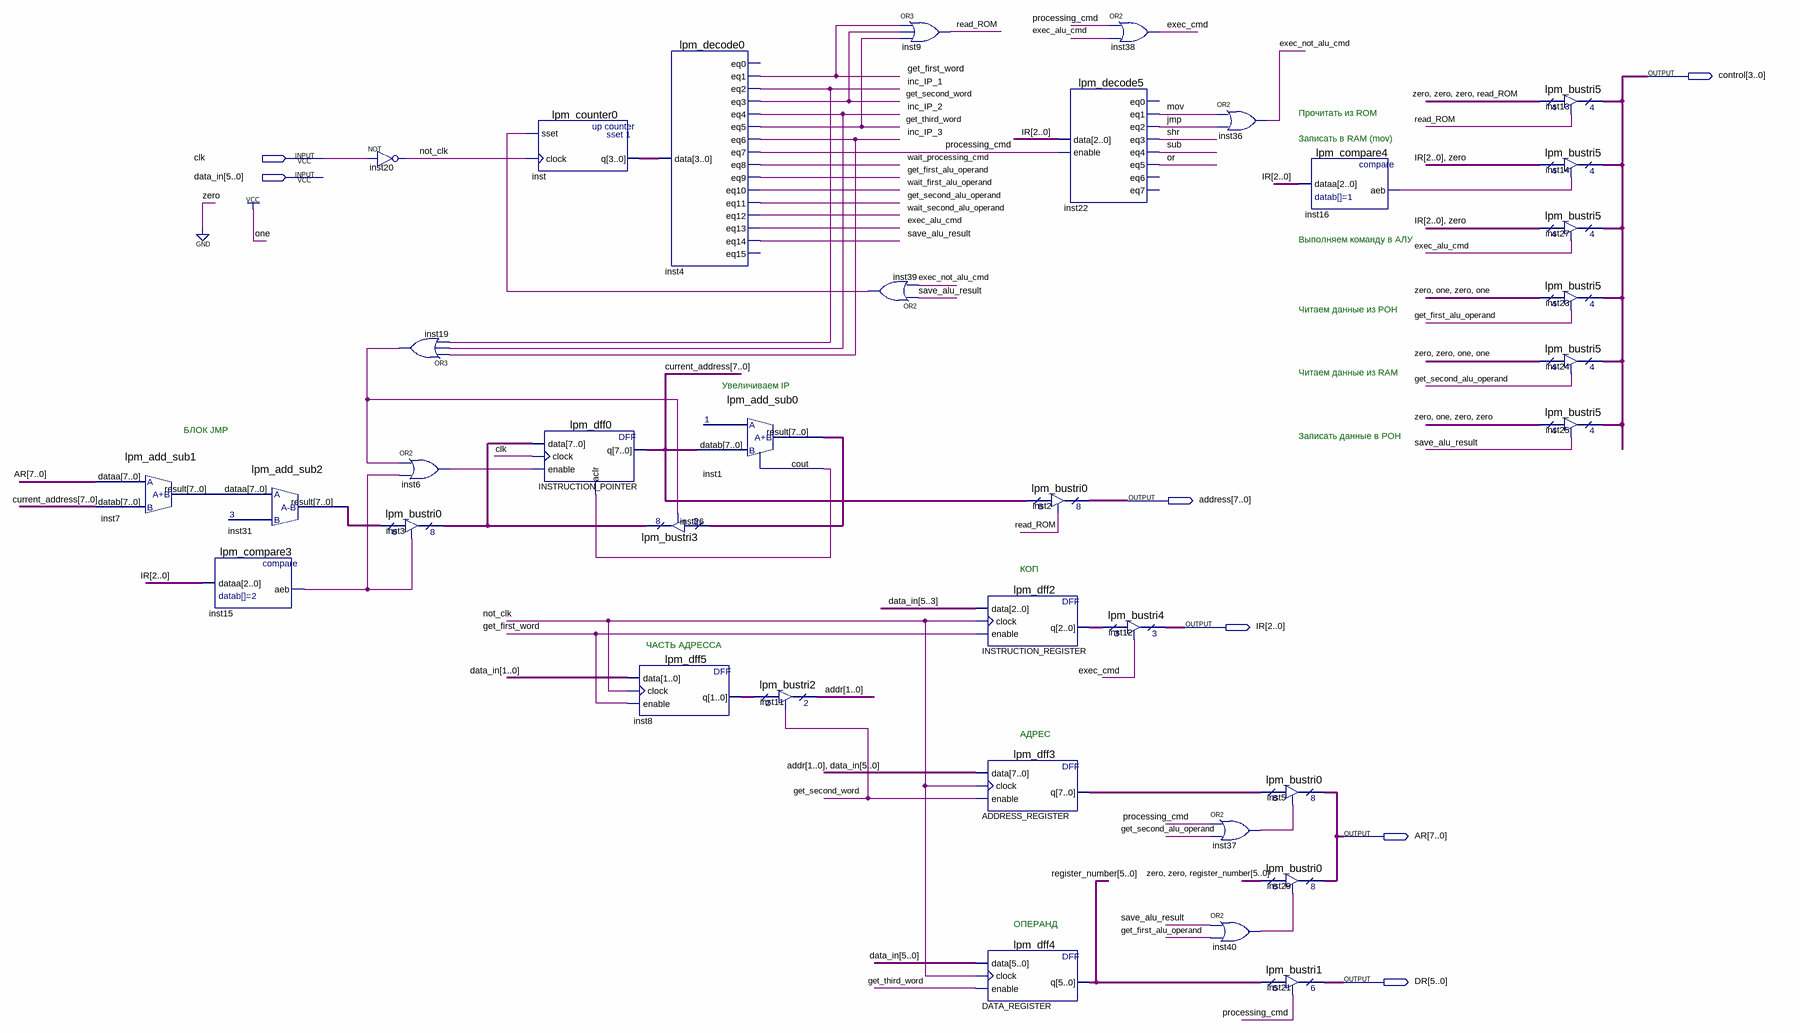
[diagram p0: schematic sheet]
// Quartus schematic control_block.bdf as structural Verilog: 36 symbols, 7 pins
module control_block (
  input  clk,
  input  [5:0] data_in,
  output [3:0] control,
  output [7:0] address,
  output [2:0] IR,
  output [7:0] AR,
  output [5:0] DR
);

  wire exec_alu_cmd, exec_cmd, exec_not_alu_cmd, get_first_alu_operand, get_first_word,
       get_second_alu_operand, get_second_word, get_third_word, inc_IP_1, inc_IP_2, inc_IP_3, inst1_cout,
       inst6_out, inst15_aeb, inst16_aeb, inst19_out, inst37_out, inst39_out, inst40_out, jmp, mov, not_clk,
       \or , processing_cmd, read_ROM, save_alu_result, shr, sub, wait_first_alu_operand,
       wait_processing_cmd, wait_second_alu_operand;
  wire [1:0] addr, inst8_q;
  wire [2:0] INSTRUCTION_REGISTER_q;
  wire [3:0] inst_q;
  wire [5:0] register_number;
  wire [7:0] ADDRESS_REGISTER_q, current_address, inst1_result, inst3_tridata, inst7_result, inst31_result;

  lpm_add_sub1 inst7 (.dataa(AR), .datab(current_address), .result(inst7_result));
  lpm_add_sub2 inst31 (.dataa(inst7_result), .result(inst31_result));
  lpm_compare3 inst15 (.dataa(IR), .aeb(inst15_aeb));
  not inst20 (not_clk, clk);
  lpm_bustri0 inst3 (.enabledt(inst15_aeb), .data(inst31_result), .tridata(inst3_tridata));
  or inst19 (inst19_out, inc_IP_3, inc_IP_2, inc_IP_1);
  or inst6 (inst6_out, inst19_out, inst15_aeb);
  lpm_counter0 inst (.sset(inst39_out), .clock(not_clk), .q(inst_q));
  lpm_dff0 INSTRUCTION_POINTER (
    .data(inst3_tridata), .clock(clk), .enable(inst6_out), .aclr(inst1_cout), .q(current_address));
  lpm_bustri3 inst26 (.enabledt(inst19_out), .data(inst1_result), .tridata(inst3_tridata));
  lpm_dff5 inst8 (.data(data_in[1:0]), .clock(not_clk), .enable(get_first_word), .q(inst8_q));
  lpm_decode0 inst4 (
    .data(inst_q), .eq1(get_first_word), .eq2(inc_IP_1), .eq3(get_second_word), .eq4(inc_IP_2),
    .eq5(get_third_word), .eq6(inc_IP_3), .eq7(processing_cmd), .eq8(wait_processing_cmd),
    .eq9(get_first_alu_operand), .eq10(wait_first_alu_operand), .eq11(get_second_alu_operand),
    .eq12(wait_second_alu_operand), .eq13(exec_alu_cmd), .eq14(save_alu_result));  // open: eq0, eq15
  lpm_add_sub0 inst1 (.datab(current_address), .result(inst1_result), .cout(inst1_cout));
  lpm_bustri2 inst11 (.enabledt(get_second_word), .data(inst8_q), .tridata(addr));
  or inst9 (read_ROM, get_first_word, get_second_word, get_third_word);
  or inst39 (inst39_out, save_alu_result, exec_not_alu_cmd);
  lpm_dff2 INSTRUCTION_REGISTER (
    .data(data_in[5:3]), .clock(not_clk), .enable(get_first_word), .q(INSTRUCTION_REGISTER_q));
  lpm_dff3 ADDRESS_REGISTER (.data({addr, data_in}), .clock(not_clk), .enable(get_second_word), .q(ADDRESS_REGISTER_q));
  lpm_dff4 DATA_REGISTER (.data(data_in), .clock(not_clk), .enable(get_third_word), .q(register_number));
  lpm_bustri0 inst2 (.enabledt(read_ROM), .data(current_address), .tridata(address));
  lpm_decode5 inst22 (
    .data(IR), .enable(processing_cmd), .eq1(mov), .eq2(jmp), .eq3(shr), .eq4(sub), .eq5(\or ));  // open: eq0, eq6, eq7
  lpm_bustri4 inst12 (.enabledt(exec_cmd), .data(INSTRUCTION_REGISTER_q), .tridata(IR));
  or inst38 (exec_cmd, processing_cmd, exec_alu_cmd);
  or inst36 (exec_not_alu_cmd, mov, jmp);
  or inst37 (inst37_out, processing_cmd, get_second_alu_operand);
  or inst40 (inst40_out, save_alu_result, get_first_alu_operand);
  lpm_compare4 inst16 (.dataa(IR), .aeb(inst16_aeb));
  lpm_bustri0 inst5 (.enabledt(inst37_out), .data(ADDRESS_REGISTER_q), .tridata(AR));
  lpm_bustri0 inst29 (.enabledt(inst40_out), .data({2'b00, register_number}), .tridata(AR));
  lpm_bustri1 inst21 (.enabledt(processing_cmd), .data(register_number), .tridata(DR));
  lpm_bustri5 inst13 (.enabledt(read_ROM), .data({3'b000, read_ROM}), .tridata(control));
  lpm_bustri5 inst14 (.enabledt(inst16_aeb), .data({IR, 1'b0}), .tridata(control));
  lpm_bustri5 inst27 (.enabledt(exec_alu_cmd), .data({IR, 1'b0}), .tridata(control));
  lpm_bustri5 inst23 (.enabledt(get_first_alu_operand), .data(4'b0101), .tridata(control));
  lpm_bustri5 inst24 (.enabledt(get_second_alu_operand), .data(4'b0011), .tridata(control));
  lpm_bustri5 inst25 (.enabledt(save_alu_result), .data(4'b0100), .tridata(control));

  // Notes on the sheet:
  //   Прочитать из ROM
  //   Записать в RAM (mov)
  //   Выполняем команду в АЛУ
  //   Читаем данные из РОН
  //   Читаем данные из RAM
  //   Увеличиваем IP
  //   БЛОК JMP
  //   Записать данные в РОН
  //   КОП
  //   ЧАСТЬ АДРЕССА
  //   АДРЕС
  //   ОПЕРАНД
endmodule
